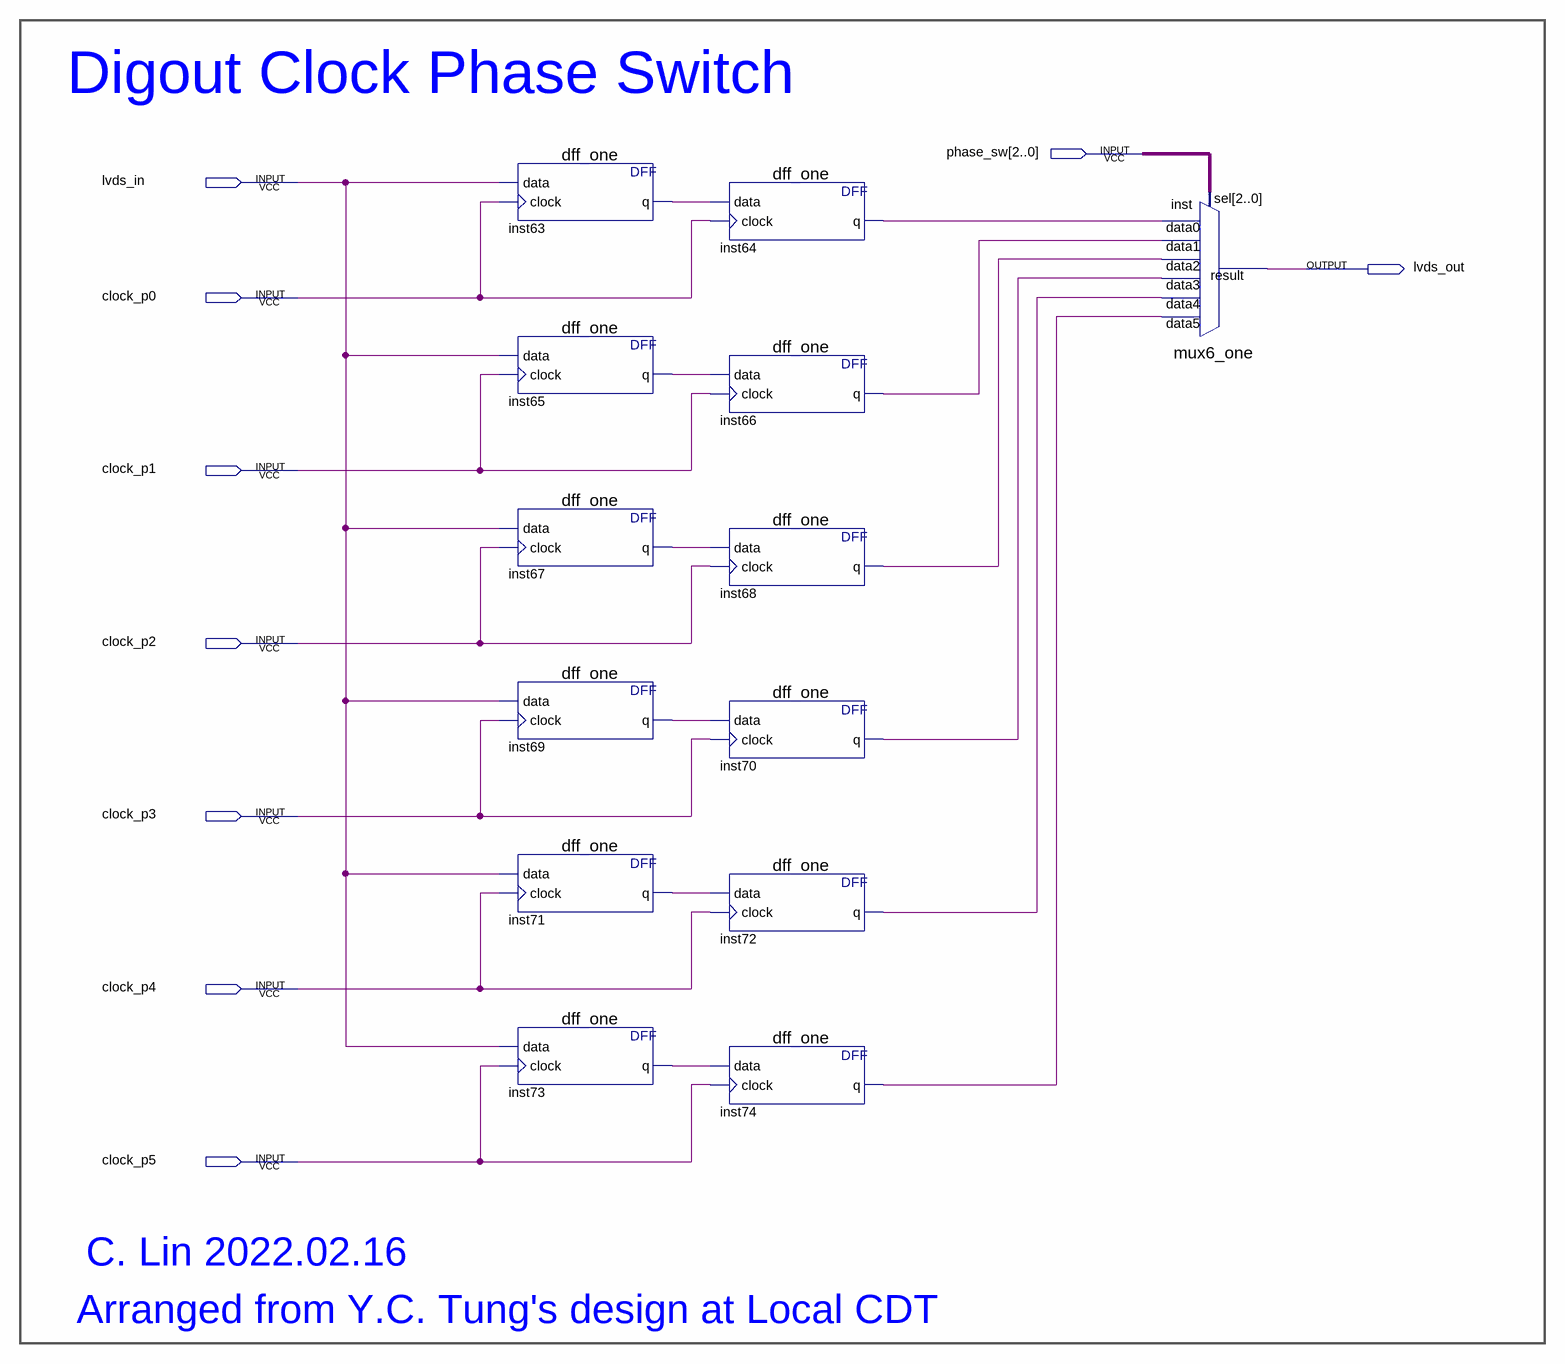
[diagram p0: schematic sheet]
// Quartus schematic digout_clock_phase_sw.bdf as structural Verilog: 13 symbols, 9 pins
module digout_clock_phase_sw (
  input  [2:0] phase_sw,
  input  lvds_in,
  input  clock_p0,
  input  clock_p1,
  input  clock_p2,
  input  clock_p3,
  input  clock_p4,
  input  clock_p5,
  output lvds_out
);

  wire inst63_q, inst64_q, inst65_q, inst66_q, inst67_q, inst68_q, inst69_q, inst70_q, inst71_q, inst72_q,
       inst73_q, inst74_q;

  dff_one inst63 (.data(lvds_in), .clock(clock_p0), .q(inst63_q));
  dff_one inst65 (.data(lvds_in), .clock(clock_p1), .q(inst65_q));
  dff_one inst67 (.data(lvds_in), .clock(clock_p2), .q(inst67_q));
  dff_one inst69 (.data(lvds_in), .clock(clock_p3), .q(inst69_q));
  dff_one inst71 (.data(lvds_in), .clock(clock_p4), .q(inst71_q));
  dff_one inst73 (.data(lvds_in), .clock(clock_p5), .q(inst73_q));
  dff_one inst64 (.data(inst63_q), .clock(clock_p0), .q(inst64_q));
  dff_one inst66 (.data(inst65_q), .clock(clock_p1), .q(inst66_q));
  dff_one inst68 (.data(inst67_q), .clock(clock_p2), .q(inst68_q));
  dff_one inst70 (.data(inst69_q), .clock(clock_p3), .q(inst70_q));
  dff_one inst72 (.data(inst71_q), .clock(clock_p4), .q(inst72_q));
  dff_one inst74 (.data(inst73_q), .clock(clock_p5), .q(inst74_q));
  mux6_one inst (
    .data5(inst74_q), .data4(inst72_q), .data3(inst70_q), .data2(inst68_q), .data1(inst66_q),
    .data0(inst64_q), .sel(phase_sw), .result(lvds_out));

  // Notes on the sheet:
  //   Digout Clock Phase Switch
  //   C. Lin 2022.02.16
  //   Arranged from Y.C. Tung's design at Local CDT
endmodule
